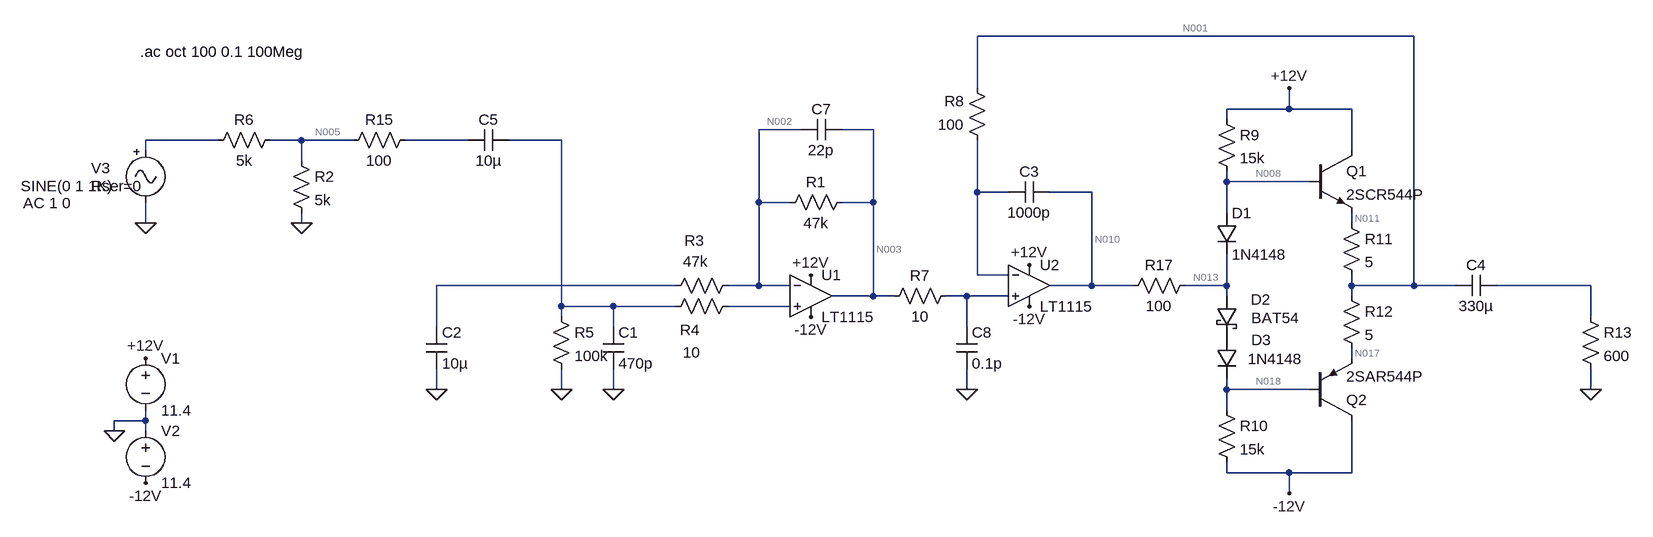
[diagram p0: schematic amp_single_sim.asc]
amp_single_sim.asc, the LTspice schematic file:
Version 4
SHEET 1 1448 680
WIRE 1072 -256 400 -256
WIRE 400 -176 400 -256
WIRE 880 -144 880 -176
WIRE 880 -144 784 -144
WIRE 976 -144 880 -144
WIRE 784 -128 784 -144
WIRE 128 -112 64 -112
WIRE 240 -112 192 -112
WIRE -768 -96 -880 -96
WIRE -640 -96 -688 -96
WIRE -560 -96 -640 -96
WIRE -384 -96 -480 -96
WIRE -240 -96 -320 -96
WIRE -880 -80 -880 -96
WIRE 976 -80 976 -144
WIRE -640 -64 -640 -96
WIRE 784 -32 784 -48
WIRE 912 -32 784 -32
WIRE 400 -16 400 -96
WIRE 448 -16 400 -16
WIRE 576 -16 512 -16
WIRE 64 0 64 -112
WIRE 112 0 64 0
WIRE 240 0 240 -112
WIRE 240 0 192 0
WIRE 784 16 784 -32
WIRE -880 32 -880 0
WIRE -640 32 -640 16
WIRE 976 32 976 16
WIRE 400 112 400 -16
WIRE 448 112 400 112
WIRE -64 128 -432 128
WIRE 64 128 64 0
WIRE 64 128 16 128
WIRE 112 128 64 128
WIRE 576 128 576 -16
WIRE 576 128 512 128
WIRE 640 128 576 128
WIRE 784 128 784 80
WIRE 784 128 720 128
WIRE 976 128 976 112
WIRE 1072 128 1072 -256
WIRE 1072 128 976 128
WIRE 1136 128 1072 128
WIRE 1344 128 1200 128
WIRE 240 144 240 0
WIRE 240 144 176 144
WIRE 272 144 240 144
WIRE 384 144 352 144
WIRE 448 144 384 144
WIRE 784 144 784 128
WIRE 976 144 976 128
WIRE -240 160 -240 -96
WIRE -160 160 -240 160
WIRE -64 160 -160 160
WIRE 112 160 16 160
WIRE -240 176 -240 160
WIRE 1344 176 1344 128
WIRE -432 192 -432 128
WIRE -160 192 -160 160
WIRE 384 192 384 144
WIRE 976 240 976 224
WIRE -432 288 -432 256
WIRE -240 288 -240 256
WIRE -160 288 -160 256
WIRE 384 288 384 256
WIRE 784 288 784 272
WIRE 912 288 784 288
WIRE 1344 288 1344 256
WIRE 784 320 784 288
WIRE -880 336 -880 320
WIRE -880 336 -928 336
WIRE -928 352 -928 336
WIRE -880 352 -880 336
WIRE 784 416 784 400
WIRE 880 416 784 416
WIRE 976 416 976 336
WIRE 976 416 880 416
WIRE 880 448 880 416
FLAG 144 112 +12V
FLAG -880 240 +12V
FLAG 144 176 -12V
FLAG -880 432 -12V
FLAG -928 352 0
FLAG 480 160 -12V
FLAG 480 96 +12V
FLAG 880 -176 +12V
FLAG 880 448 -12V
FLAG 1344 288 0
FLAG 384 288 0
FLAG -880 32 0
FLAG -160 288 0
FLAG -240 288 0
FLAG -432 288 0
FLAG -640 32 0
SYMBOL Opamps\\LT1115 144 80 R0
SYMATTR InstName U1
SYMBOL res 208 -16 R90
WINDOW 0 0 56 VBottom 2
WINDOW 3 32 56 VTop 2
SYMATTR InstName R1
SYMATTR Value 47k
SYMBOL res 32 112 R90
WINDOW 0 -38 67 VBottom 2
WINDOW 3 -37 65 VTop 2
SYMATTR InstName R3
SYMATTR Value 47k
SYMBOL res 32 144 R90
WINDOW 0 68 74 VBottom 2
WINDOW 3 71 71 VTop 2
SYMATTR InstName R4
SYMATTR Value 10
SYMBOL voltage -880 224 R0
WINDOW 123 0 0 Left 2
WINDOW 39 24 44 Left 2
SYMATTR InstName V1
SYMATTR Value 11.4
SYMBOL voltage -880 336 R0
WINDOW 123 0 0 Left 2
WINDOW 39 0 0 Left 2
SYMATTR InstName V2
SYMATTR Value 11.4
SYMBOL res 368 128 R90
WINDOW 0 0 56 VBottom 2
WINDOW 3 32 56 VTop 2
SYMATTR InstName R7
SYMATTR Value 10
SYMBOL Opamps\\LT1115 480 64 R0
SYMATTR InstName U2
SYMBOL cap 512 -32 R90
WINDOW 0 0 32 VBottom 2
WINDOW 3 32 32 VTop 2
SYMATTR InstName C3
SYMATTR Value 1000p
SYMBOL res 416 -80 R180
WINDOW 0 36 76 Left 2
WINDOW 3 36 40 Left 2
SYMATTR InstName R8
SYMATTR Value 100
SYMBOL diode 768 16 R0
SYMATTR InstName D1
SYMATTR Value 1N4148
SYMBOL diode 768 208 R0
WINDOW 0 54 4 Left 2
WINDOW 3 48 33 Left 2
SYMATTR InstName D3
SYMATTR Value 1N4148
SYMBOL res 768 -144 R0
SYMATTR InstName R9
SYMATTR Value 15k
SYMBOL res 768 304 R0
SYMATTR InstName R10
SYMATTR Value 15k
SYMBOL res 960 16 R0
SYMATTR InstName R11
SYMATTR Value 5
SYMBOL res 960 128 R0
SYMATTR InstName R12
SYMATTR Value 5
SYMBOL npn 912 -80 R0
SYMATTR InstName Q1
SYMATTR Value 2SCR544P
SYMBOL pnp 912 336 M180
SYMATTR InstName Q2
SYMATTR Value 2SAR544P
SYMBOL cap 1200 112 R90
WINDOW 0 0 32 VBottom 2
WINDOW 3 32 32 VTop 2
SYMATTR InstName C4
SYMATTR Value 330µ
SYMBOL res 1328 160 R0
SYMATTR InstName R13
SYMATTR Value 600
SYMBOL cap -320 -112 R90
WINDOW 0 0 32 VBottom 2
WINDOW 3 32 32 VTop 2
SYMATTR InstName C5
SYMATTR Value 10µ
SYMBOL Misc\\signal -880 -96 R0
WINDOW 0 -84 43 Left 2
WINDOW 3 -192 71 Left 2
WINDOW 123 -188 97 Left 2
WINDOW 39 -84 71 Left 2
SYMATTR InstName V3
SYMATTR Value2 AC 1 0
SYMATTR SpiceLine Rser=0
SYMBOL cap 192 -128 R90
WINDOW 0 0 32 VBottom 2
WINDOW 3 32 32 VTop 2
SYMATTR InstName C7
SYMATTR Value 22p
SYMBOL schottky 768 144 R0
WINDOW 0 53 5 Left 2
WINDOW 3 54 34 Left 2
SYMATTR InstName D2
SYMATTR Value BAT54
SYMBOL cap 368 192 R0
SYMATTR InstName C8
SYMATTR Value 0.1p
SYMBOL res -464 -112 R90
WINDOW 0 0 56 VBottom 2
WINDOW 3 32 56 VTop 2
SYMATTR InstName R15
SYMATTR Value 100
SYMBOL res 736 112 R90
WINDOW 0 0 56 VBottom 2
WINDOW 3 32 56 VTop 2
SYMATTR InstName R17
SYMATTR Value 100
SYMBOL res -256 160 R0
SYMATTR InstName R5
SYMATTR Value 100k
SYMBOL cap -176 192 R0
SYMATTR InstName C1
SYMATTR Value 470p
SYMBOL cap -448 192 R0
SYMATTR InstName C2
SYMATTR Value 10µ
SYMBOL res -656 -80 R0
SYMATTR InstName R2
SYMATTR Value 5k
SYMBOL res -672 -112 R90
WINDOW 0 0 56 VBottom 2
WINDOW 3 32 56 VTop 2
SYMATTR InstName R6
SYMATTR Value 5k
TEXT -888 -232 Left 2 !.ac oct 100 0.1 100Meg

The netlist it stands for:
* amp_single_sim.asc
XU1 N016 N002 +12V -12V N003 LT1028  ; LT1115, pins In+ In- V+ V- OUT
R1 N003 N002 47k
R3 N002 N012 47k
R4 N016 N007 10
V1 +12V 0 11.4
V2 0 -12V 11.4
R7 N015 N003 10
XU2 N015 N009 +12V -12V N010 LT1028  ; LT1115, pins In+ In- V+ V- OUT
C3 N010 N009 1000p
R8 N009 N001 100
D1 N008 N013 1N4148
D3 P001 N018 1N4148
R9 +12V N008 15k
R10 N018 -12V 15k
R11 N011 N001 5
R12 N001 N017 5
Q1 +12V N008 N011 0 2SCR544P
Q2 -12V N018 N017 0 2SAR544P
C4 N014 N001 330µ
R13 N014 0 600
C5 N007 N006 10µ
V3 N004 0 SINE(0 1 1K) AC 1 0 Rser=0
C7 N003 N002 22p
D2 N013 P001 BAT54
C8 N015 0 0.1p
R15 N006 N005 100
R17 N013 N010 100
R5 N007 0 100k
C1 N007 0 470p
C2 N012 0 10µ
R2 N005 0 5k
R6 N005 N004 5k
.model D D
.lib standard.dio
.model NPN NPN
.model PNP PNP
.lib standard.bjt
.ac oct 100 0.1 100Meg
.lib LTC.lib
.backanno
.end

* Results of the author's LTspice run, read from the files saved beside the schematic
* Operating Point, zero values left out:
*   V(+12v) = 11.4 V
*   V(-12v) = -11.4 V
*   V(n010) = 120 mV
*   V(n008) = 685.6 mV
*   V(n013) = 119.8 mV
*   V(p001) = -109.3 mV
*   V(n018) = -675.2 mV
*   V(n011) = 71.27 mV
*   V(n017) = -71.27 mV
*   Ic(Q2) = -14.2 mA
*   Ib(Q2) = -51.65 µA
*   Ie(Q2) = 14.25 mA
*   Ic(Q1) = 14.2 mA
*   Ib(Q1) = 53.06 µA
*   Ie(Q1) = -14.25 mA
*   I(D2) = 663.3 µA
*   I(D3) = 663.3 µA
*   I(D1) = 661.2 µA
*   I(R17) = -2.104 µA
*   I(R12) = 14.25 mA
*   I(R11) = 14.25 mA
*   I(R10) = 715 µA
*   I(R9) = 714.3 µA
*   I(V2) = -29.69 mA
*   I(V1) = -29.69 mA
*   Ix(u1:3) = 7.387 mA
*   Ix(u1:4) = -7.387 mA
*   Ix(u2:3) = 7.388 mA
*   Ix(u2:4) = -7.386 mA
*   Ix(u2:5) = -2.104 µA
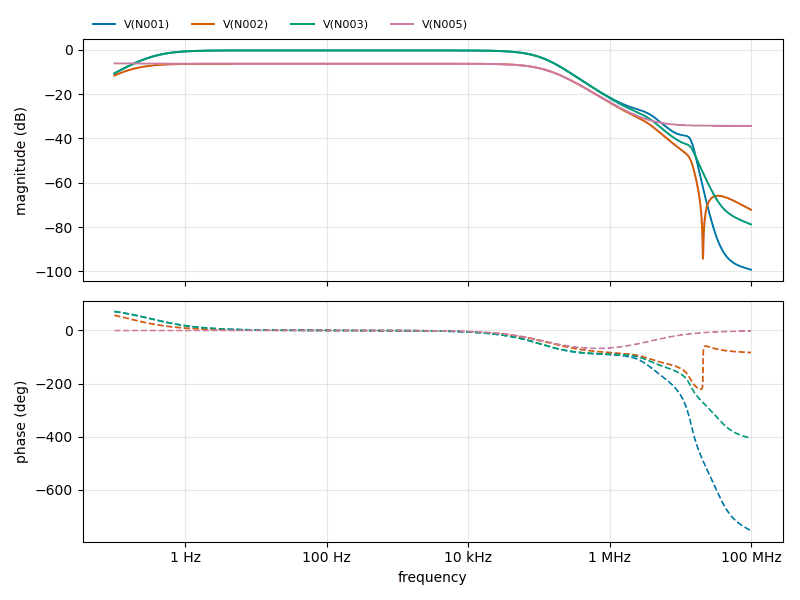
[diagram p1: AC Analysis of amp_single_sim.asc, plotted from the saved traces]
* AC Analysis, 1 run:
*   V(N001): -10.63 dB at 100 mHz, -99.26 dB at 100 MHz, peak -0.22 dB at 189.8 Hz, 3 dB below the peak at 327.3 mHz and 103.2 kHz
*   V(N002): -11.57 dB at 100 mHz, -72.21 dB at 100 MHz, peak -6.24 dB at 142.8 Hz, 3 dB below the peak at 155.1 mHz and 132 kHz
*   V(N003): -10.63 dB at 100 mHz, -78.82 dB at 100 MHz, peak -0.22 dB at 189.8 Hz, 3 dB below the peak at 327.3 mHz and 103.1 kHz
*   V(N005): -6.08 dB at 100 mHz, -34.31 dB at 100 MHz, peak -6.08 dB at 100 mHz, 3 dB below the peak at 127.7 kHz